# Altium project IR_Sensor_Array.PrjPcb
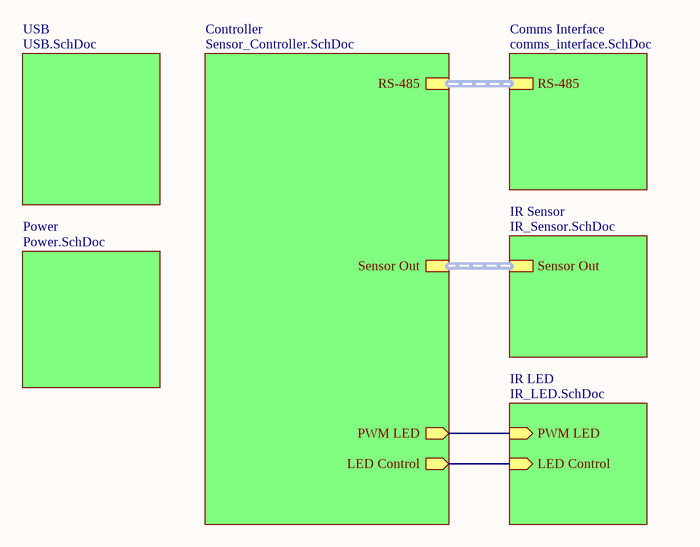
[diagram p0: root.SchDoc]
7 sheets, 89 parts. Net scope: hierarchical (ports join the sheet entries above them; power ports are global).
Board file: PCB.PcbDoc
Sheets:
  root.SchDoc
    Controller = Sensor_Controller.SchDoc
    IR LED = IR_LED.SchDoc
    IR Sensor = IR_Sensor.SchDoc
    Comms Interface = comms_interface.SchDoc
    Power = Power.SchDoc
    USB = USB.SchDoc

## Sheet root.SchDoc
size A4; SheetNumber: 1; SheetTotal: 7

### Sub-sheets
Comms Interface = comms_interface.SchDoc: RS-485
Controller = Sensor_Controller.SchDoc: RS-485, Sensor Out, PWM LED (out), LED Control (out)
IR LED = IR_LED.SchDoc: PWM LED (in), LED Control (in)
IR Sensor = IR_Sensor.SchDoc: Sensor Out
Power = Power.SchDoc: no entries
USB = USB.SchDoc: no entries

### Nets
LED Control: sheet Controller/LED Control, sheet IR LED/LED Control
PWM LED: sheet Controller/PWM LED, sheet IR LED/PWM LED

### Buses and harness runs
harness sheet Comms Interface/RS-485 = sheet Controller/RS-485
harness sheet Controller/Sensor Out = sheet IR Sensor/Sensor Out

## Sheet Sensor_Controller.SchDoc
size A4; SheetNumber: 2; SheetTotal: 7
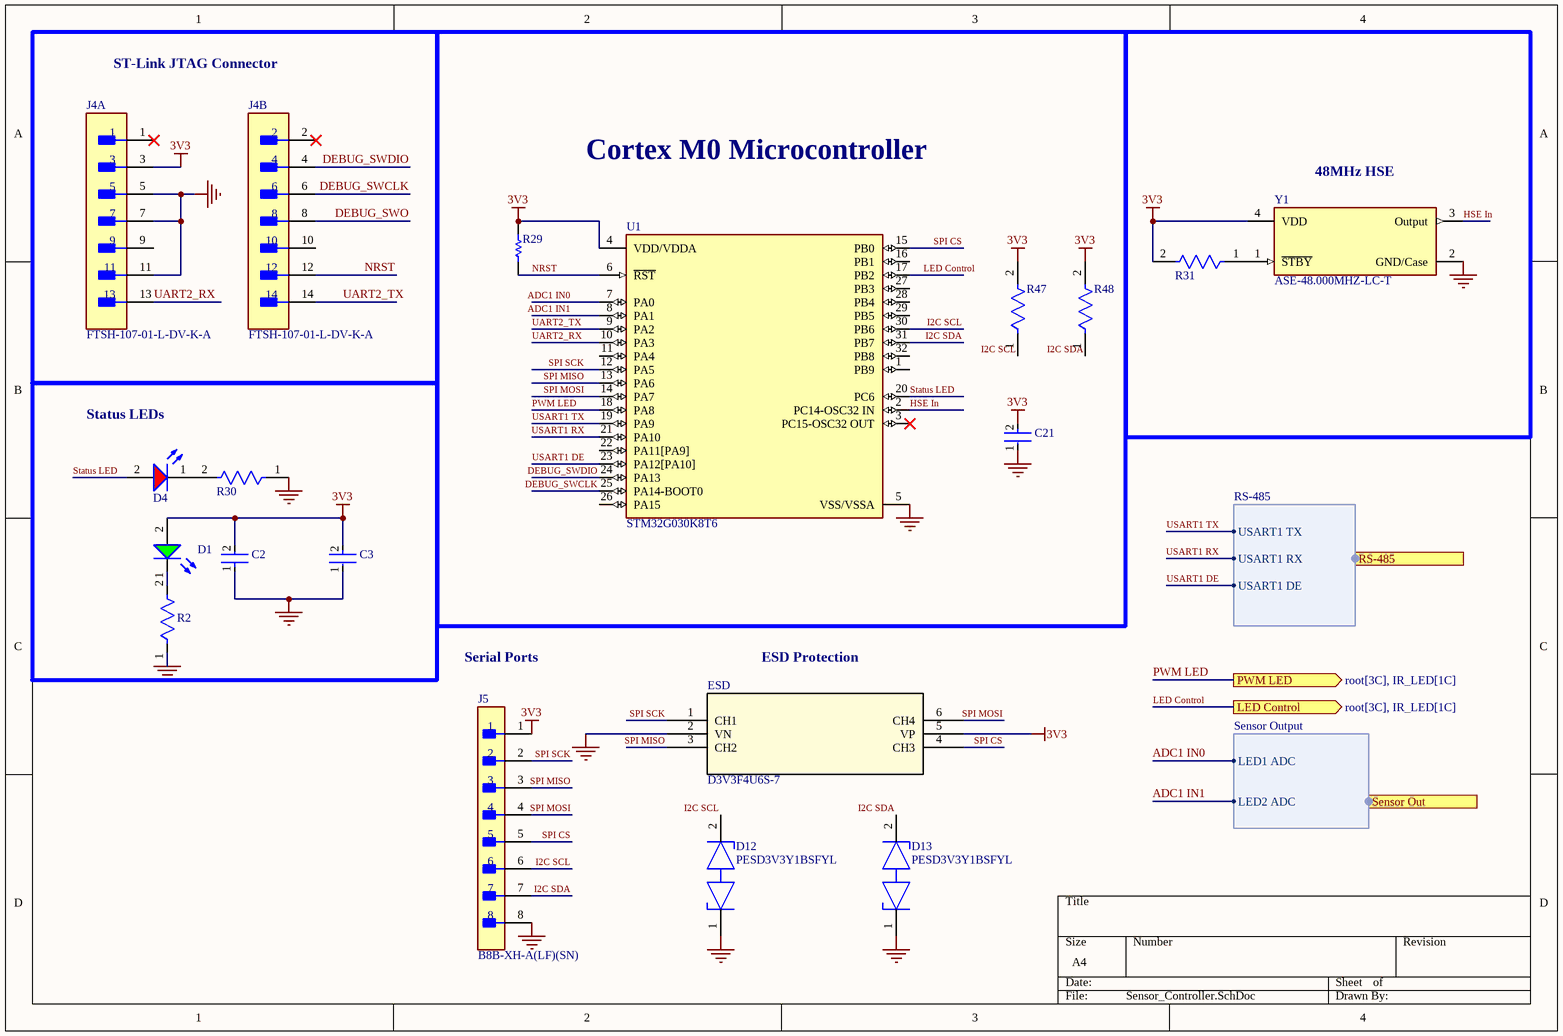
[diagram p1: Sensor_Controller.SchDoc]

### Parts
C2  GRM188R6YA475KE15D  [FP-GRM188-0_2-IPC_C]  (value not drawn)
C3  GRM155R71C104KA88D  [FP-GRM15-MFG]  (value not drawn)
C21  GRM155R71C104KA88D  [FP-GRM15-MFG]  (value not drawn)
D1  150060VS75000  [WL-SMCW_0603_150060xx75000]  (value not drawn)
D4  150060SS75000  [WL-SMCW_0603_150060xx75000]  (value not drawn)
D12  PESD3V3Y1BSFYL  [FP-SOD962-2-CA-MFG]
D13  PESD3V3Y1BSFYL  [FP-SOD962-2-CA-MFG]
ESD  D3V3F4U6S-7  [SOT-363_DIO]
J4  FTSH-107-01-L-DV-K-A  [FP-FTSH-107-01-L-DV-K-A-MFG]  (parts A,B of 2)
J5  B8B-XH-A(LF)(SN)  [FP-B8B-XH-A_LF_SN-MFG]
R2  RC0603FR-0710KL  [FP-RC0603-0_55-IPC_C]  (value not drawn)
R29  TNPW040210K0DEED  [RESC1005X40X20NL05T10]  (value not drawn)
R30  RC0603FR-0710KL  [FP-RC0603-0_55-IPC_C]  (value not drawn)
R31  RC0603FR-0710KL  [FP-RC0603-0_55-IPC_C]  (value not drawn)
R47  CRCW08053K30JNEC  [FP-CRCW0805-e3-IPC_A]  (value not drawn)
R48  CRCW08053K30JNEC  [FP-CRCW0805-e3-IPC_A]  (value not drawn)
U1  STM32G030K8T6  [FP-LQFP32-5V-IPC_A]
Y1  ASE-48.000MHZ-LC-T  [FP-ASE-MFG]

### Blocks framed on the sheet
ST-Link JTAG Connector: J4
Cortex M0 Microcontroller: C21 R29 R47 R48 U1
48MHz HSE: R31 Y1
Status LEDs: C2 C3 D1 D4 R2 R30

### Ports
LED Control (out, see root[3C], IR_LED[1C]), PWM LED (out, see root[3C], IR_LED[1C]), RS-485 (harness RS-485, see root[3B], comms_interface[1D]), Sensor Out (harness Sensor Output, see root[3B], IR_Sensor[4D])

### Harnesses
Sensor Output: LED1 ADC, LED2 ADC
RS-485: USART1 TX, USART1 RX, USART1 DE

### Nets
3V3: C2.2 C3.2 C21.2 D1.2(A) ESD.5(VP) J4.3 J5.1 R29.2 R31.2 R47.2 R48.2 U1.4(VDD/VDDA) Y1.4(VDD)
GND: C2.1 C3.1 C21.1 D12.1 D13.1 ESD.2(VN) J4.5 J4.7 J4.11 J5.8 R2.1 R30.1 U1.5(VSS/VSSA) Y1.2(GND/Case)
ADC1 IN0: U1.7(PA0) ; port Sensor Out.LED1 ADC
ADC1 IN1: U1.8(PA1) ; port Sensor Out.LED2 ADC
DEBUG_SWCLK: J4.6 U1.25(PA14-BOOT0)
DEBUG_SWDIO: J4.4 U1.24(PA13)
DEBUG_SWO: J4.8
HSE In: U1.2(PC14-OSC32_IN) Y1.3(Output)
I2C SCL: D12.2 J5.6 R47.1 U1.30(PB6)
I2C SDA: D13.2 J5.7 R48.1 U1.31(PB7)
LED Control: U1.17(PB2) ; port LED Control
NRST: J4.12 R29.1 U1.6(~{RST})
PWM LED: U1.18(PA8) ; port PWM LED
SPI CS: ESD.4(CH3) J5.5 U1.15(PB0)
SPI MISO: ESD.3(CH2) J5.3 U1.13(PA6)
SPI MOSI: ESD.6(CH4) J5.4 U1.14(PA7)
SPI SCK: ESD.1(CH1) J5.2 U1.12(PA5)
Status LED: D4.2(A) U1.20(PC6)
UART2_RX: J4.13 U1.10(PA3)
UART2_TX: J4.14 U1.9(PA2)
USART1 DE: U1.23(PA12[PA10]) ; port RS-485.USART1 DE  [project net Direction Control]
USART1 RX: U1.21(PA10) ; port RS-485.USART1 RX  [project net RX]
USART1 TX: U1.19(PA9) ; port RS-485.USART1 TX  [project net TX]
NetD1_1: D1.1(K) R2.2
NetD4_1: D4.1(K) R30.2
NetR31_1: R31.1 Y1.1(~{STBY})

Not connected (* = marked no-connect by the designer): J4 1* 2* 9 10; U1 1(PB9) 3(PC15-OSC32_OUT)* 11(PA4) 16(PB1) 22(PA11[PA9]) 26(PA15) 27(PB3) 28(PB4) 29(PB5) 32(PB8)

### Notes on the sheet
- Serial Ports
- ESD Protection

### Library data of the parts
C2 = CMP-2006-02545-2: Chip Multilayer Ceramic Capacitors for General Purpose, 0603, 4.7uF, X5R, 15%, 10%, 35V; Lead Free: Lead Free; Max Operating Temperature: 85°C; Case Code (Imperial): 0603; Capacitance: 4.7uF; Width: 0.8mm; Thickness: 0.031inch; Case Code (Metric): 1608; Min Operating Temperature: -55°C; Voltage Rating (DC): 35V; Dielectric: X5R; Voltage: 35V; Packaging: Tape and Reel; Resistor Type: Ceramic; Weight: 0.000222oz; Mount: Surface Mount; Material: Ceramic; Depth: 0.8mm; Tolerance: 10%; REACH SVHC: No SVHC; Case/Package: 0603; Voltage Rating: 35V; Package Quantity: 4000; Height: 0.8mm; Length: 1.6mm; Termination: SMD/SMT
C3 C21 = CMP-2100-03641-2: CAP CER 0.1UF 16V X7R 0402; Manufacturer: Murata; Standoff Height: 0mm; Tolerance: 10%; Voltage Rating: 16Vdc; Material: Ceramic; Capacitance: 0.10μF; Value: 0.10μF; RoHS: TRUE; Manufacturer Part Number: GRM155R71C104KA88D; Temperature Characteristic: X7R; Octopart: https://octopart.com/grm155r71c104ka88d-murata-196880; Digikey Description: CAP CER 0.1UF 16V X7R 0402; Device Class L3: Ceramic Capacitors; Height: 0.55mm; ComponentLink2Description: Datasheet; Temperature Range Low: -55°C; Ipc Land Pattern Name: CAPC10050X219; ComponentLink2URL: https://search.murata.co.jp/Ceramy/image/img/A01X/G101/ENG/GRM155R71H471KA01-01A.pdf; Device Class L1: Passive Components; Lead Free: yes; Category: Cap; Package: GRM15; Temperature: -55°C to +125°C; Device Class L2: Capacitors; Temperature Range High: +125°C; Mouser Description: 0402 0.1 uF 16V ±10 % Tolerance X7R SMT Multilayer Ceramic Capacitor
D1 = CMP-1426-00006-7: WURTH ELEKTRONIK - 150060VS75000 - LED, Green, SMD, 0603, 30 mA, 2 V, 570 nm; Reverse Voltage: 5V; Power Dissipation: 72mW; Dominant Wavelength: 570nm; Peak Wavelength: 572nm; Forward Current: 100mA; Forward Voltage: 2V; Lens Style: Clear, Rectangular; Test Current: 20mA; Max Junction Temperature (Tj): 95°C; Viewing Angle: 140°; Luminous Intensity: 40mcd; Height: 700µm; Width: 800µm; Length: 1.6mm; Mount: Surface Mount; Min Operating Temperature: -40°C; Max Reverse Voltage (DC): 5V; Case Code (Imperial): 0603; Wavelength: 570nm; Color: Green; REACH SVHC: Unknown; RoHS: Compliant; Max Operating Temperature: 85°C; Packaging: Tape and Reel; Case/Package: 0603; Number of Pins: 2; Case Code (Metric): 1608
D4 = CMP-1426-00004-3: Led, Red, 630 Nm, 1.9 V, 30 Ma, 60 Mcd Rohs Compliant: Yes; Dominant Wavelength: 630nm; Lens Style: Clear, Rectangular; Forward Current: 100mA; Test Current: 20mA; Viewing Angle: 140°; Forward Voltage: 1.9V; Peak Wavelength: 645nm; Max Reverse Voltage (DC): 5V; Luminous Intensity: 60mcd; Color: Red; Height: 700µm; Min Operating Temperature: -40°C; Case Code (Imperial): 0603; REACH SVHC: Unknown; RoHS: Compliant; Length: 1.6mm; Case Code (Metric): 1608; Mount: Surface Mount; Wavelength: 630nm; Packaging: Tape and Reel; Max Operating Temperature: 85°C; Width: 800µm; Case/Package: 0603
D12 D13 = CMP-11424-92175759-2: PESD3V3Y1BSFYL PESD4V0Y1BSF - Extremely low capacitance bidirectional ESD protection diode; Manufacturer Lifecycle Status: RELEASED FOR SUPPLY; Number of Channels: 1; Breakdown Voltage: 4.2V; Clamping Voltage: 3.7V; Capacitance: 240fF; Reverse Standoff Voltage: 3.3V; Height: 320µm; RoHS: Non-Compliant; Ambient Temperature Range High: 125°C; NexarPartId: 92175759; Direction: Bidirectional; Lifecycle Status: Production; Schedule B: 8536300000
ESD = D3V3F4U6S-7: No Description Available; Manufacturer_Name: Diodes Inc; Copyright: Copyright (C) 2026 Ultra Librarian. All rights reserved.; Manufacturer_Part_Number: D3V3F4U6S-7; RefDes: RefDes; Type: Type
J4 = CMP-02766-001414-1: CONN HEADER SMD 14POS 1.27MM; Number of Contacts: 14; Gender: Male; Contact Plating: Gold; Termination: Solder; Lead Free: Lead Free; Contact Material: Bronze; Pitch: 1.27mm; Number of Rows: 2; RoHS Compliant: Yes
J5 = CMP-17438-000015-1: CONN HEADER VERT 8POS 2.5MM; Voltage Rating (AC): 250V; Insulation Resistance: 1GR; Connector Type: Male Pin; Max Current Rating: 3A; Wire/Cable Gauge: 22AWG; Number of Contacts: 8; Contact Resistance: 20mR; Orientation: Straight; Pitch: 2.5mm; Min Operating Temperature: -25°C; Number of Rows: 1; Contact Type: Male Pin; Packaging: Bulk; Lead Free: Lead Free; Max Operating Temperature: 85°C; Housing Material: Polyamide; Voltage Rating: 250V; Series: XH; Mount: Through Hole; Depth: 5.75mm; Contact Material: Brass; Fastening Type: Detent; Color: Natural; Max Voltage Rating (AC): 250V; Number of Positions: 8; Housing Color: White; Contact Plating: Tin; Lead Pitch: 2.5mm; Length: 22.4mm; REACH SVHC: No SVHC; Termination: Press-Fit; Current Rating: 3A
R2 R30 R31 = CMP-2100-03664-2: RES 10K OHM 1% 1/10W 0603; Voltage Rating: 75V; Voltage Rating (DC): 50V; Resistance: 10kR; Power Rating: 100mW; Temperature Coefficient: 100ppm/°C; Depth: 0.8mm; Termination: SMD/SMT; Resistor Type: Thick Film; Series: RC; Construction: Rectangular; Features: Moisture Resistant; Packaging: Tape and Reel; Min Operating Temperature: -55°C; Number of Terminations: 2; Lead Pitch: 0.3mm; RoHS Compliant: Yes; Case/Package: 0603; Resistance Tolerance: 1%; Military Standard: Not; Weight: 7.1E-05oz; Number of Pins: 2; Tolerance: 1%; Length: 1.6mm; Case Code (Imperial): 0603; Lead Free: Lead Free; Width: 0.8mm; Max Power Dissipation: 100mW; Height: 0.45mm; Max Operating Temperature: 155°C; Case Code (Metric): 1608; Size Code: 0603
R29 = CMP-2002-01682-1: Manufacturer: Vishay BCcomponents; Part Number: TNPW040210K0DEED
R47 R48 = CMP-02407-009350-1: RES Thick Film, 3.3kΩ, 5%, 0.125W, 200ppm/°C, 0805; Resistance: 3.3kR; Max Power Dissipation: 125mW; Width: 0.049inch; Contact Plating: Tin; Length: 0.079inch; Height: 0.02inch; Features: Automotive AEC-Q200; Case/Package: 0805; Tolerance: 5%; Min Operating Temperature: -55°C; Number of Terminations: 2; Temperature Coefficient: 200ppm/°C; Lead Free: Lead Free; Packaging: Tape and Reel; Radiation Hardening: No; Max Operating Temperature: 155°C; Package Quantity: 20000; Composition: Thick Film
U1 = CMP-12105-000136-1: IC MCU 32BIT 64KB FLASH 32LQFP; RoHS Compliant: Yes
Y1 = CMP-27762-000273-1: XTAL Oscillator 48MHz ±50ppm CMOS 3.3V 4-SMD 3.2mm x 2.5mm; Min Supply Voltage: 3.135V; Max Supply Voltage: 3.465V; Load Capacitance: 15pF; Max Supply Current: 19mA; Series: ASE; Radiation Hardening: No; Lead Free: Lead Free; Package Quantity: 1000; Frequency: 48MHz; Frequency Stability: 50ppm; Case/Package: SMD/SMT; REACH SVHC: No SVHC; Operating Frequency: 48 MHz; Mount: Surface Mount; Min Operating Temperature: -40°C; Packaging: Tape and Reel; Max Operating Temperature: 85°C; Depth: 2.5mm; Height: 0.047inch; Width: 0.098inch; Length: 3.2mm; Termination: SMD/SMT; Number of Pins: 4; Operating Supply Voltage: 3.3V

## Sheet IR_LED.SchDoc
size A4; SheetNumber: 3; SheetTotal: 7
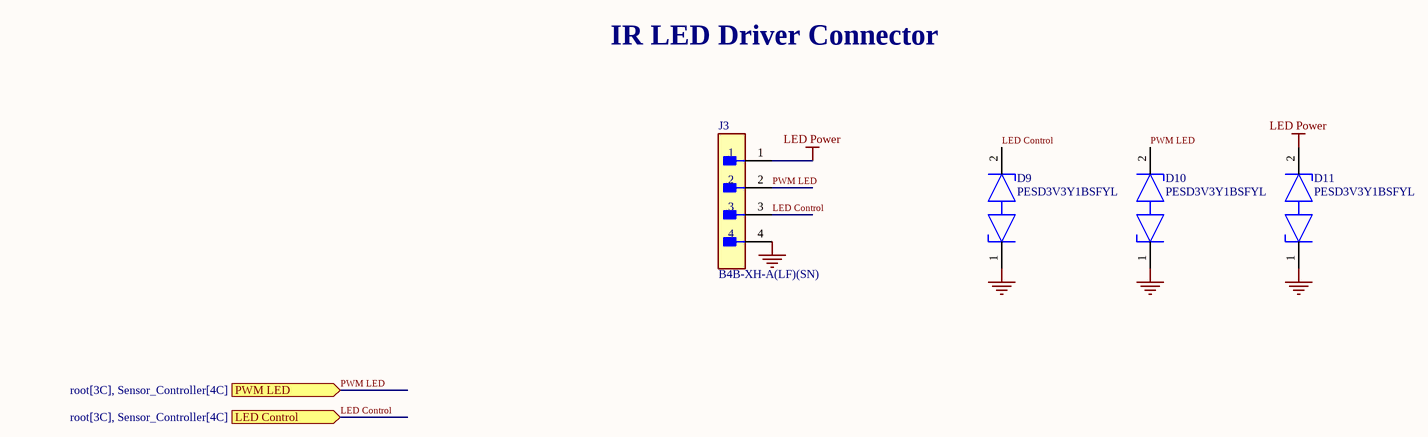
[diagram p2: IR_LED.SchDoc]

### Parts
D9  PESD3V3Y1BSFYL  [FP-SOD962-2-CA-MFG]
D10  PESD3V3Y1BSFYL  [FP-SOD962-2-CA-MFG]
D11  PESD3V3Y1BSFYL  [FP-SOD962-2-CA-MFG]
J3  B4B-XH-A(LF)(SN)  [FP-B4B-XH-A_LF_SN-MFG]

### Ports
LED Control (in, see root[3C], Sensor_Controller[4C]), PWM LED (in, see root[3C], Sensor_Controller[4C])

### Nets
GND: D9.1 D10.1 D11.1 J3.4
LED Power: D11.2 J3.1
LED Control: D9.2 J3.3 ; port LED Control
PWM LED: D10.2 J3.2 ; port PWM LED

### Notes on the sheet
- IR LED Driver Connector

### Library data of the parts
D9-D11 = CMP-11424-92175759-2: as D12 on sheet Sensor_Controller; Height: 320µm; RoHS: Non-Compliant; Ambient Temperature Range High: 125°C; NexarPartId: 92175759; Direction: Bidirectional; Lifecycle Status: Production; Schedule B: 8536300000
J3 = CMP-17439-000250-1: CONN HEADER VERT 4POS 2.5MM; Number of Contacts: 4; Contact Resistance: 20mR; Voltage Rating: 250V; Max Current Rating: 3A; Gender: Male; Wire/Cable Gauge: 22AWG; Mated Stacking Heights: 9.8mm; Insulation Resistance: 1GR; Orientation: Straight; Contact Type: Male Pin; Contact Finish - Mating: TIN; Series: XH; Max Voltage Rating (AC): 250V; Lead Pitch: 2.5mm; Contact Shape: Square; Insulation Color: Natural; Termination: Solder; Lead Free: Lead Free; Voltage Rating (AC): 250V; Number of Rows: 1; Flammability Rating: UL94 V-0; Number of Positions: 4; Max Operating Temperature: 85°C; Package Quantity: 500; Mount: Through Hole; REACH SVHC: No SVHC; Connector Type: Header; Insulation Material: Nylon; Fastening Type: Detent; Min Operating Temperature: -25°C; Housing Color: White; Packaging: Bulk; Contact Plating: Tin; Contact Material: Brass; Max Voltage Rating (DC): 250V; Housing Material: Polyamide; Color: Natural; Material: Polyamide; Pitch: 2.5mm; Depth: 5.75mm; Current Rating: 3A; Length: 12.4mm

## Sheet IR_Sensor.SchDoc
size A4; SheetNumber: 4; SheetTotal: 7
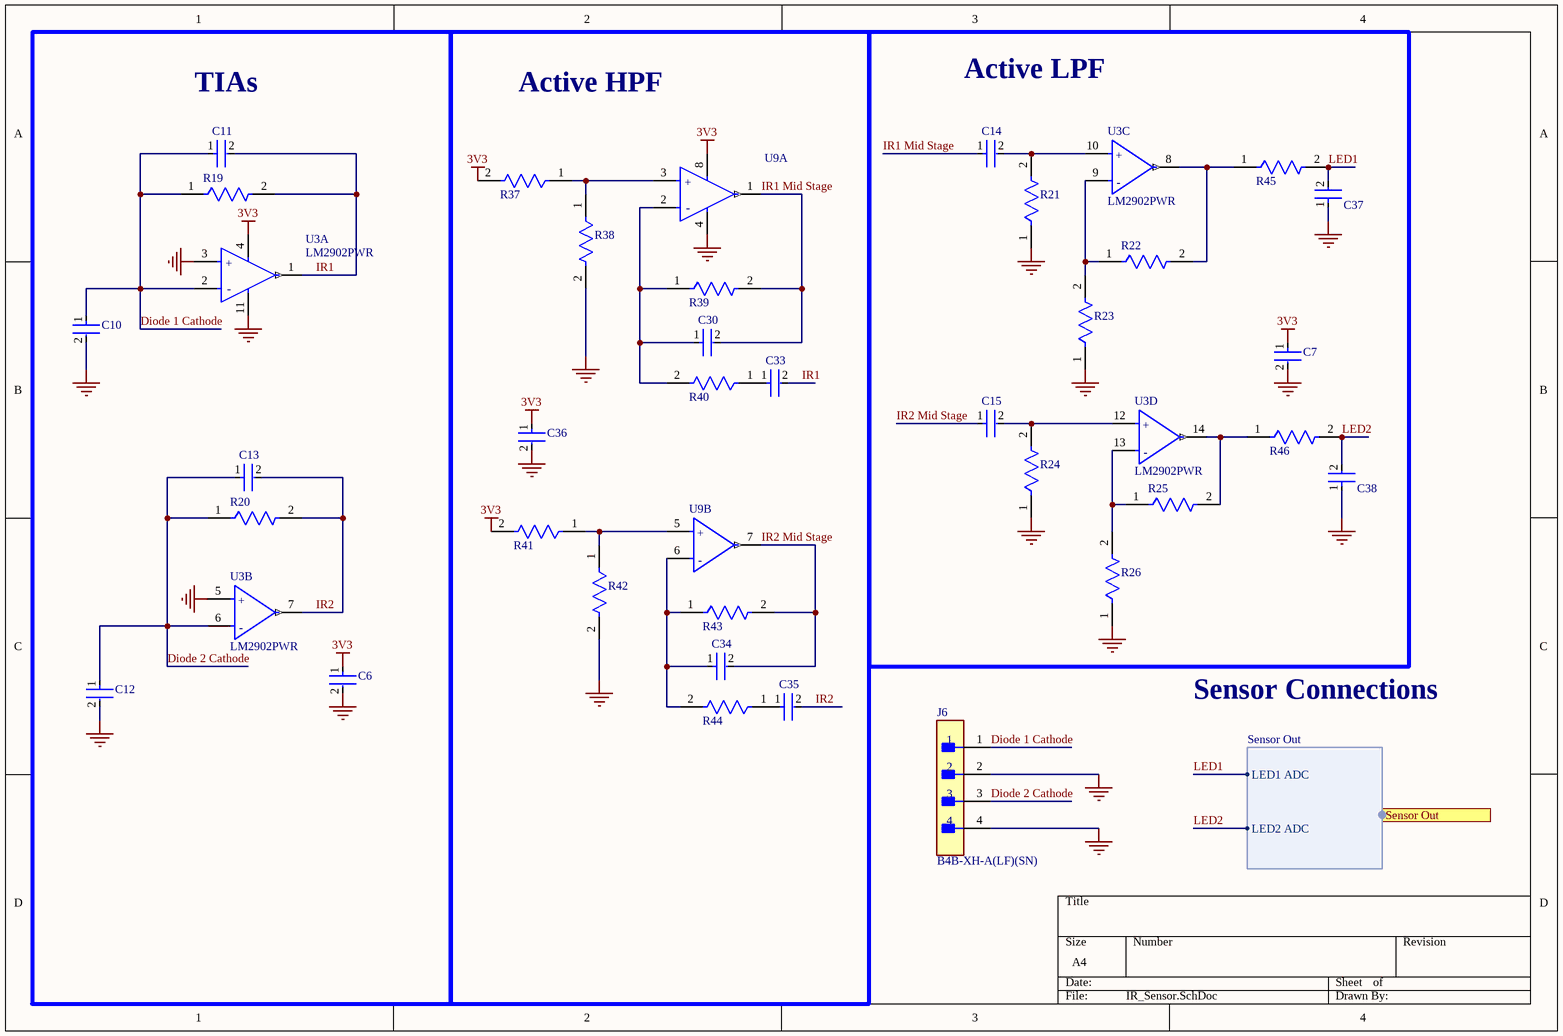
[diagram p3: IR_Sensor.SchDoc]

### Parts
C6  LMK105B7104KVHF  [FP-0402-L_1_0_0_05-W_0_5-IPC_B]  (value not drawn)
C7  LMK105B7104KVHF  [FP-0402-L_1_0_0_05-W_0_5-IPC_B]  (value not drawn)
C10  GCM1555C1H4R0CA16D  [FP-GCM155-0_05-MFG]  (value not drawn)
C11  C0603C100D5GACAUTO  [FP-C0603C-CF-MFG]  (value not drawn)
C12  GCM1555C1H4R0CA16D  [FP-GCM155-0_05-MFG]  (value not drawn)
C13  C0603C100D5GACAUTO  [FP-C0603C-CF-MFG]  (value not drawn)
C14  C0603C104K3RACTU  [FP-C0603C-CF-MFG]  (value not drawn)
C15  C0603C104K3RACTU  [FP-C0603C-CF-MFG]  (value not drawn)
C30  C0603C100D5GACAUTO  [FP-C0603C-CF-MFG]  (value not drawn)
C33  C0603C104K3RACTU  [FP-C0603C-CF-MFG]  (value not drawn)
C34  C0603C100D5GACAUTO  [FP-C0603C-CF-MFG]  (value not drawn)
C35  C0603C104K3RACTU  [FP-C0603C-CF-MFG]  (value not drawn)
C36  LMK105B7104KVHF  [FP-0402-L_1_0_0_05-W_0_5-IPC_B]  (value not drawn)
C37  C0603C104K3RACTU  [FP-C0603C-CF-MFG]  (value not drawn)
C38  C0603C104K3RACTU  [FP-C0603C-CF-MFG]  (value not drawn)
J6  B4B-XH-A(LF)(SN)  [FP-B4B-XH-A_LF_SN-MFG]
R19  MCT0603MD1002DP500  [FP-MCT0603-IPC_A]  (value not drawn)
R20  MCT0603MD1002DP500  [FP-MCT0603-IPC_A]  (value not drawn)
R21  AC0603JR-0747KL  [FP-AC0603-IPC_A]  (value not drawn)
R22  RT0603DRE073K3L  [FP-RT0603-MFG]  (value not drawn)
R23  AT0603BRD071KL  [FP-AT0603-IPC_A]  (value not drawn)
R24  AC0603JR-0747KL  [FP-AC0603-IPC_A]  (value not drawn)
R25  RT0603DRE073K3L  [FP-RT0603-MFG]  (value not drawn)
R26  AT0603BRD071KL  [FP-AT0603-IPC_A]  (value not drawn)
R37  CRCW0603100KFKEI  [FP-CRCW0603-e3-MFG]  (value not drawn)
R38  CRCW0603100KFKEI  [FP-CRCW0603-e3-MFG]  (value not drawn)
R39  CRCW0603100KFKEI  [FP-CRCW0603-e3-MFG]  (value not drawn)
R40  AC0603JR-7W10KL  [FP-AC0603-IPC_A]  (value not drawn)
R41  CRCW0603100KFKEI  [FP-CRCW0603-e3-MFG]  (value not drawn)
R42  CRCW0603100KFKEI  [FP-CRCW0603-e3-MFG]  (value not drawn)
R43  CRCW0603100KFKEI  [FP-CRCW0603-e3-MFG]  (value not drawn)
R44  AC0603JR-7W10KL  [FP-AC0603-IPC_A]  (value not drawn)
R45  CRCW0603100KFKEI  [FP-CRCW0603-e3-MFG]  (value not drawn)
R46  CRCW0603100KFKEI  [FP-CRCW0603-e3-MFG]  (value not drawn)
U3  LM2902PWR  [FP-PW0014A-IPC_C]  (parts A,B,C,D of 4)
U9  LMV358AIDR  [FP-D0008A-IPC_C]  (value not drawn)  (parts A,B of 2)

### Blocks framed on the sheet
TIAs: C6 C10-C13 R19 R20 U3
Active HPF: C30 C33-C36 R37-R44 U9
Active LPF: C7 C14 C15 C37 C38 R21-R26 R45 R46 U3

### Ports
Sensor Out (harness Sensor Out, see root[3B], Sensor_Controller[4D])

### Harnesses
Sensor Out: LED2 ADC, LED1 ADC

### Nets
3V3: C6.1 C7.1 C36.1 R37.2 R41.2 U3.4(VCC) U9.8(V+)
GND: C6.2 C7.2 C10.2 C12.2 C36.2 C37.1 C38.1 J6.2 J6.4 R21.1 R23.1 R24.1 R26.1 R38.2 R42.2 U3.3(1IN+) U3.5(2IN+) U3.11(GND) U9.4(V-)
Diode 1 Cathode: C10.1 C11.1 J6.1 R19.1 U3.2(1IN-)
Diode 2 Cathode: C12.1 C13.1 J6.3 R20.1 U3.6(2IN-)
IR1: C11.2 C33.2 R19.2 U3.1(1OUT)
IR1 Mid Stage: C14.1 C30.2 R39.2 U9.1(OUT_A)
IR2: C13.2 C35.2 R20.2 U3.7(2OUT)
IR2 Mid Stage: C15.1 C34.2 R43.2 U9.7(OUT_B)
LED1: C37.2 R45.2 ; port Sensor Out.LED1 ADC  [project net ADC1 IN0]
LED2: C38.2 R46.2 ; port Sensor Out.LED2 ADC  [project net ADC1 IN1]
NetC14_2: C14.2 R21.2 U3.10(3IN+)
NetC15_2: C15.2 R24.2 U3.12(4IN+)
NetC30_1: C30.1 R39.1 R40.2 U9.2(-IN_A)
NetC33_1: C33.1 R40.1
NetC34_1: C34.1 R43.1 R44.2 U9.6(-IN_B)
NetC35_1: C35.1 R44.1
NetR22_1: R22.1 R23.2 U3.9(3IN-)
NetR22_2: R22.2 R45.1 U3.8(3OUT)
NetR25_1: R25.1 R26.2 U3.13(4IN-)
NetR25_2: R25.2 R46.1 U3.14(4OUT)
NetR37_1: R37.1 R38.1 U9.3(+IN_A)
NetR41_1: R41.1 R42.1 U9.5(+IN_B)

### Notes on the sheet
- Sensor Connections
- (in symbol CMP-04895-000145-1, part A) +; -
- (in symbol CMP-04895-000145-1, part B) +; -
- (in symbol CMP-04895-000145-1, part C) +; -
- (in symbol CMP-04895-000145-1, part D) +; -
- (in symbol CMP-04895-000233-1, part A) +; -
- (in symbol CMP-04895-000233-1, part B) +; -

### Library data of the parts
C6 C7 C36 = CMP-14477-001294-2: None; Tolerance: 10%; Voltage Rating: 10V; Capacitance: 100nF; Lead Free: Lead Free; Case/Package: 0402; Length: 0.039inch; Thickness: 0.022inch; Halogen Free: Halogen Free; Mount: Surface Mount; Packaging: Tape and Reel; Width: 0.02inch; Case Code (Metric): 1005; Voltage Rating (DC): 10V; Case Code (Imperial): 0402; Min Operating Temperature: -55°C; RoHS Compliant: Yes; Max Operating Temperature: 125°C; Ratings: AEC-Q200
C10 C12 = CMP-06035-062171-1: Ceramic Capacitor for Automotive 4pF ±0.25pF 50VDC C0G 0402 Paper T/R; Voltage Rating: 50V; Mount: Surface Mount; Min Operating Temperature: -55°C; Package Quantity: 10000; Case/Package: 0402; Case Code (Imperial): 0402; Thickness: 0.022inch; Dielectric: C0G; Length: 0.039inch; Ratings: AEC-Q200; Max Operating Temperature: 125°C; Voltage Rating (DC): 50V; Packaging: Tape and Reel; RoHS Compliant: Yes; Termination: SMD/SMT; Weight: 0.000212oz; Capacitance: 4pF; Case Code (Metric): 1005; Width: 0.02inch; Height: 0.5mm
C11 C13 C30 C34 = CMP-03020-010987-1: C0603 10 pF C0G 30ppm/°C 0.5 pF 50 V; Manufacturer: KEMET; Tolerance: 0.5 pF; Automotive Grade: Grade 1; Value: 10 pF; Material: Ceramic; Voltage Rating: 50 V; ComponentLink2URL: https://api.kemet.com/component-edge/download/datasheet/C0603C100J5GACAUTO.pdf; Manufacturer Part Number: C0603C100D5GACAUTO; Temperature Range High: +125°C; Height: 0.87mm; Device Class L3: Ceramic Capacitors; Octopart: https://octopart.com/c0603c100d5gacauto-kemet-81425946; RoHS: TRUE; Temperature: -55°C to +125°C; Lead Free: Yes; Temperature Characteristic: C0G; Category: Cap; ComponentLink2Description: Datasheet; Capacitance: 10 pF; Device Class L2: Capacitors; Temperature Coefficient: 30ppm/°C; Device Class L1: Passive Components; Automotive: Yes; Package: C0603C-CF; Temperature Range Low: -55°C
C14 C15 C33 C35 C37 C38 = CMP-2006-03057-2: CAP CER 0.1UF 25V X7R 0603; Manufacturer: KEMET; Value: 0.10 μF; Material: Ceramic; Tolerance: 0.1; Temperature Coefficient: 30ppm/°C; Automotive Grade: Grade 1; Lead Free: Yes; Device Class L3: Ceramic Capacitors; Voltage Rating: 25 V; Manufacturer Part Number: C0603C104K3RACTU; Digikey Description: CAP CER 0.1UF 25V X7R 0603; Mouser Description: Multilayer Ceramic Capacitors MLCC - SMD/SMT 25volts 0.1uF X7R 10%; Package: C0603C-CF; Temperature Range Low: -55°C; Automotive: Yes; Device Class L2: Capacitors; Octopart: https://octopart.com/c0603c104k3ractu-kemet-127541; ComponentLink2Description: Datasheet; ComponentLink2URL: https://api.kemet.com/component-edge/download/datasheet/C0603C100J5GACAUTO.pdf; Temperature Range High: +125°C; RoHS: TRUE; Device Class L1: Passive Components; Category: Cap; Temperature: -55°C to +125°C; Capacitance: 0.10 μF; Height: 0.87mm; Temperature Characteristic: X7R
J6 = CMP-17439-000250-1: as J3 on sheet IR_LED; Orientation: Straight; Contact Type: Male Pin; Contact Finish - Mating: TIN; Series: XH; Max Voltage Rating (AC): 250V; Lead Pitch: 2.5mm; Contact Shape: Square; Insulation Color: Natural; Termination: Solder; Lead Free: Lead Free; Voltage Rating (AC): 250V; Number of Rows: 1; Flammability Rating: UL94 V-0; Number of Positions: 4; Max Operating Temperature: 85°C; Package Quantity: 500; Mount: Through Hole; REACH SVHC: No SVHC; Connector Type: Header; Insulation Material: Nylon; Fastening Type: Detent; Min Operating Temperature: -25°C; Housing Color: White; Packaging: Bulk; Contact Plating: Tin; Contact Material: Brass; Max Voltage Rating (DC): 250V; Housing Material: Polyamide; Color: Natural; Material: Polyamide; Pitch: 2.5mm; Depth: 5.75mm; Current Rating: 3A; Length: 12.4mm
R19 R20 = CMP-02407-010942-1: RES SMD 100 OHM 1% 1/8W 0603; Power Rating: 125mW; Resistance: 10kR; Tolerance: 0.5%; Temperature Coefficient: 25ppm/°C; Max Power Dissipation: 150mW; Voltage Rating: 75V; Case Code (Imperial): 0603; Case Code (Metric): 1608; Military Standard: Not; Lead Free: Lead Free; Max Operating Temperature: 175°C; Length: 1.55mm; Height: 0.022inch; Min Operating Temperature: -55°C; Width: 0.8mm; Package Quantity: 1; Contact Plating: Tin; Termination: Wraparound; Composition: Thin Film; Case/Package: 0603; Number of Terminations: 2; Depth: 0.85mm; Features: Automotive AEC-Q200; Mount: Surface Mount; Voltage Rating (DC): 75V; Packaging: Tape and Reel; REACH SVHC: No SVHC
R21 R24 = CMP-03412-049221-1: RES 47kΩ 5.00% 0.1W 0603; Resistance: 47kR; Tolerance: 5%; Temperature Coefficient: 100ppm/°C; Max Power Dissipation: 100mW; Voltage Rating: 50V; Packaging: Tape and Reel; Series: AC; Ratings: AEC-Q200; Case Code (Metric): 1608; Case Code (Imperial): 0603; Resistor Type: Thick Film; Max Operating Temperature: 155°C; Case/Package: 0603; Features: Moisture Resistant; Height: 0.45mm; Termination: SMD/SMT; Length: 1.6mm; Min Operating Temperature: -55°C; Number of Terminations: 2; Width: 0.8mm; RoHS Compliant: Yes; Power Rating: 100mW
R22 R25 = CMP-03412-032896-1: RES 3.30K OHM 1/10W .5% SMD 0603; Manufacturer: Yageo; Resistance: 3.3KΩ; Value: 3.3KΩ; Voltage Rating: 75V; Power Rating: 0.1W; Tolerance: 0.005; Temperature Coefficient: 50 ppm/°C; Composition: Thin Film; Ipc Land Pattern Name: RESC16080X45; ComponentLink2URL: http://www.yageo.com/documents/recent/PYu-RT_1-to-0.01_RoHS_L_9.pdf; Mouser Description: High Precision-High Stability Chip Resistor Thin Film 0603 3.3kOhm 0.5% Paper T/R; Automotive: No; Temperature Range High: +155°C; Device Class L3: Chip SMD Resistors; RoHS: TRUE; Lead Free: Yes; Octopart: https://octopart.com/rt0603dre073k3l-yageo-1479702; Series: RT; Digikey Description: RES 3.30K OHM 1/10W .5% SMD 0603; Device Class L2: Resistors; Manufacturer Part Number: RT0603DRE073K3L; Temperature Range Low: -55°C; Package: RT0603; Category: Res; Footprint Url: http://www.yageo.com/exep/pages/download/literatures/PYu-R_Mount_10.pdf; Temperature: -55°C to +155°C; ComponentLink2Description: Datasheet; Height: 0.55mm; Device Class L1: Passive Components
R23 R26 = CMP-03412-045054-1: Thin Film Chip Resistors Automotive Grade 1kΩ 0.1% 25ppm/°C 0603; Resistance: 1kR; Max Power Dissipation: 100mW; RoHS Compliant: Yes; Case Code (Metric): 1608; Features: Moisture Resistant; Tolerance: 0.1%; Case/Package: 0603; Temperature Coefficient: 25ppm/°C; Height: 0.022inch; Max Operating Temperature: 155°C; Width: 0.032inch; Ratings: AEC-Q200; Series: AT; Length: 0.063inch; Case Code (Imperial): 0603; Packaging: Cut Tape; Resistor Type: Thin Film; Number of Terminations: 2; Min Operating Temperature: -55°C
R37-R39 R41-R43 R45 R46 = CMP-02407-005189-1: RES Thick Film, 100kΩ, 1%, 0.1W, 100ppm/°C, 0603; Resistance: 100kR; Max Power Dissipation: 100mW; Number of Terminations: 2; Temperature Coefficient: 100ppm/°C; Composition: Thick Film; Max Operating Temperature: 155°C; Packaging: Tape and Reel; Lead Free: Lead Free; Min Operating Temperature: -55°C; Case/Package: 0603; Tolerance: 1%; Height: 0.02inch; Length: 0.061inch; Package Quantity: 5000; Width: 0.033inch; Features: Automotive AEC-Q200
R40 R44 = CMP-03412-040683-1: RES 10kΩ 5.00% 0.2W 0603
U3 = CMP-04895-000145-1: IC OPAMP GP 4 CIRCUIT 14TSSOP; Min Supply Voltage: 3V; Operating Supply Voltage: 13V; Unity Gain Bandwidth Product: 1.2MHz; Slew Rate: 0.5V/µs; Dual Supply Voltage: 9V; Voltage Gain: 100dB; Common Mode Rejection Ratio: 50dB; Input Offset Voltage (Vos): 7mV; Operating Supply Current: 1.4mA; Min Dual Supply Voltage: 1.5V; Number of Channels: 4; Output Current per Channel: 60mA; Output Current: 30mA; Nominal Supply Current: 3mA; Input Bias Current: 250nA; Max Supply Voltage: 26V; Min Operating Temperature: -40°C; Max Operating Temperature: 125°C; Mount: Surface Mount; REACH SVHC: No SVHC; Max Dual Supply Voltage: 13V; Lead Free: Lead Free; Number of Pins: 14; Length: 5mm; Width: 4.4mm; Gain Bandwidth Product: 1.2MHz; Height: 1.15mm; Radiation Hardening: No; Package Quantity: 1; Number of Circuits: 4; Packaging: Tape and Reel; Bandwidth: 1.2MHz; Case/Package: TSSOP; Number of Amplifiers: 4; Number of Elements: 4
U9 = CMP-04895-000233-1: IC OPAMP GP 2 CIRCUIT 8SOIC; Gain Bandwidth Product: 1MHz; Number of Channels: 2; Input Offset Voltage (Vos): 1mV; Operating Supply Current: 80uA; Input Bias Current: 10pA; Slew Rate: 1.7V/µs; Min Operating Temperature: -40°C; Number of Circuits: 2; Packaging: Cut Tape; Case/Package: SOIC; RoHS Compliant: Yes; Number of Pins: 8; Mount: Surface Mount; Max Operating Temperature: 125°C

## Sheet comms_interface.SchDoc
size A4; SheetNumber: 5; SheetTotal: 7
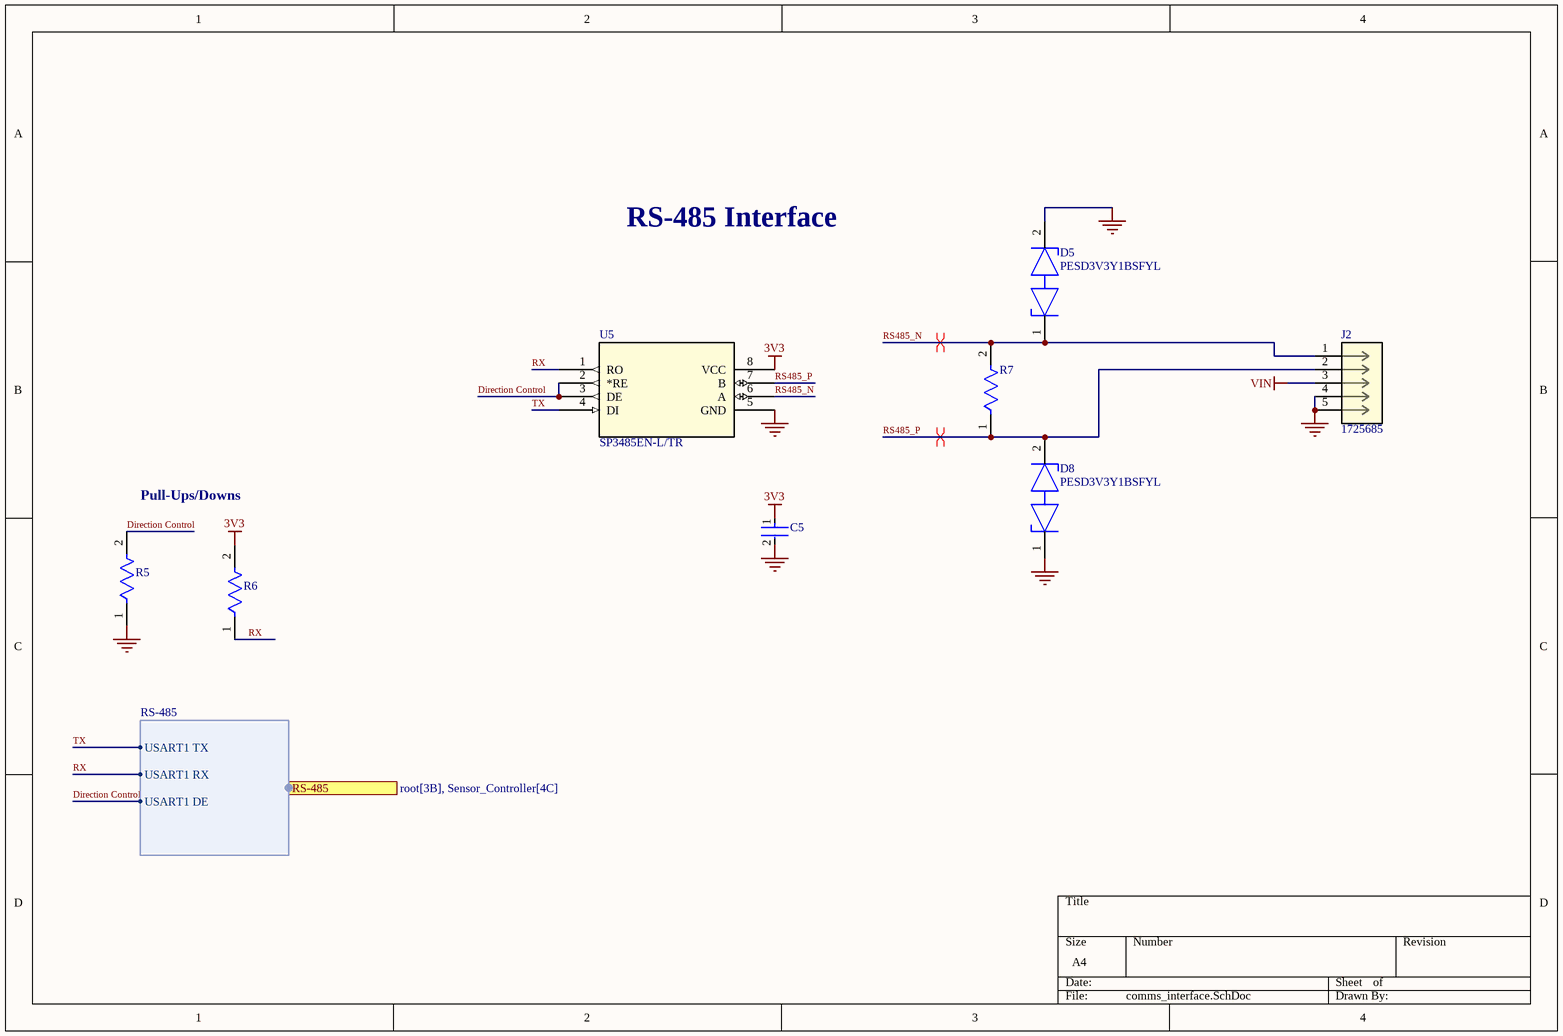
[diagram p4: comms_interface.SchDoc]

### Parts
C5  LMK105B7104KVHF  [FP-0402-L_1_0_0_05-W_0_5-IPC_B]  (value not drawn)
D5  PESD3V3Y1BSFYL  [FP-SOD962-2-CA-MFG]
D8  PESD3V3Y1BSFYL  [FP-SOD962-2-CA-MFG]
J2  1725685  [CONN_1725685_PXC]
R5  AF0402FR-073K3L  [FP-AF0402-IPC_B]  (value not drawn)
R6  AF0402FR-073K3L  [FP-AF0402-IPC_B]  (value not drawn)
R7  AF0402FR-07120RL  [FP-AF0402-IPC_A]  (value not drawn)
U5  SP3485EN-L/TR  [NSOIC-8]

### Ports
RS-485 (harness RS-485, see root[3B], Sensor_Controller[4C])

### Harnesses
RS-485: USART1 TX, USART1 RX, USART1 DE

### Nets
3V3: C5.1 R6.2 U5.8(VCC)
GND: C5.2 D5.2 D8.1 J2.4 J2.5 R5.1 U5.5(GND)
VIN: J2.3
Direction Control: R5.2 U5.2(*RE) U5.3(DE) ; port RS-485.USART1 DE
RS485_N: D5.1 J2.1 R7.2 U5.6(A)
RS485_P: D8.2 J2.2 R7.1 U5.7(B)
RX: R6.1 U5.1(RO) ; port RS-485.USART1 RX
TX: U5.4(DI) ; port RS-485.USART1 TX

### Layout directives
differential pair: RS485_N, RS485_P

### Notes on the sheet
- RS-485 Interface
- Pull-Ups/Downs

### Library data of the parts
C5 = CMP-14477-001294-2: as C6 on sheet IR_Sensor; Lead Free: Lead Free; Case/Package: 0402; Length: 0.039inch; Thickness: 0.022inch; Halogen Free: Halogen Free; Mount: Surface Mount; Packaging: Tape and Reel; Width: 0.02inch; Case Code (Metric): 1005; Voltage Rating (DC): 10V; Case Code (Imperial): 0402; Min Operating Temperature: -55°C; RoHS Compliant: Yes; Max Operating Temperature: 125°C; Ratings: AEC-Q200
D5 D8 = CMP-11424-92175759-2: as D12 on sheet Sensor_Controller; Height: 320µm; RoHS: Non-Compliant; Ambient Temperature Range High: 125°C; NexarPartId: 92175759; Direction: Bidirectional; Lifecycle Status: Production; Schedule B: 8536300000
J2 = 1725685: PCB terminal block, nominal current: 6 A, rated voltage (III/2): 160 V, nominal cross section: 0.5 mmÂ², number of potentials: 5, number of rows: 1, number of positions per row: 5, product range: MPT 0,5, pitch: 2.54 mm, connection method: Screw connection with tension sleeve, screw head form: L Slotted, mounting: Wave soldering, conductor/PCB connection direction: 0 Â°, color: green, Pin layout: Linear pinning, Solder pin [P]: 3.5 mm, number of solder pins per potential: 1, type of packaging: packed in cardboard; Manufacturer_Name: Phoenix Contact; Copyright: Copyright (C) 2026 Ultra Librarian. All rights reserved.; Manufacturer_Part_Number: 1725685; RefDes: RefDes; Type: Type
R5 R6 = CMP-03412-043110-1: Anti-Sulfurated Chip Resistors Automotive Grade 3.3kΩ 1% 100ppm/°C 0402; Max Power Dissipation: 63mW; Resistance: 3.3kR; Length: 0.039inch; Min Operating Temperature: -55°C; Case/Package: 0402; Width: 0.02inch; Height: 0.015inch; Resistor Type: Thick Film; Max Operating Temperature: 155°C; Temperature Coefficient: 100ppm/°C; RoHS Compliant: Yes; Features: Moisture Resistant; Series: AF; Number of Terminations: 2; Tolerance: 1%; Packaging: Tape and Reel
R7 = CMP-03412-046039-1: Anti-Sulfurated Chip Resistors Automotive Grade 120Ω 1% 100ppm/°C 0402; Resistance: 120R; Max Power Dissipation: 63mW; RoHS Compliant: Yes; Resistor Type: Thick Film; Length: 0.039inch; Case/Package: 0402; Temperature Coefficient: 100ppm/°C; Number of Terminations: 2; Packaging: Tape and Reel; Min Operating Temperature: -55°C; Height: 0.015inch; Tolerance: 1%; Max Operating Temperature: 155°C; Features: Moisture Resistant; Width: 0.02inch; Series: AF
U5 = SP3485EN-LTR: No Description Available; Manufacturer_Name: MaxLinear / Exar; Copyright: Copyright (C) 2026 Ultra Librarian. All rights reserved.; Manufacturer_Part_Number: SP3485EN-L/TR; RefDes: RefDes; Type: Type

## Sheet Power.SchDoc
size A4; SheetNumber: 6; SheetTotal: 7
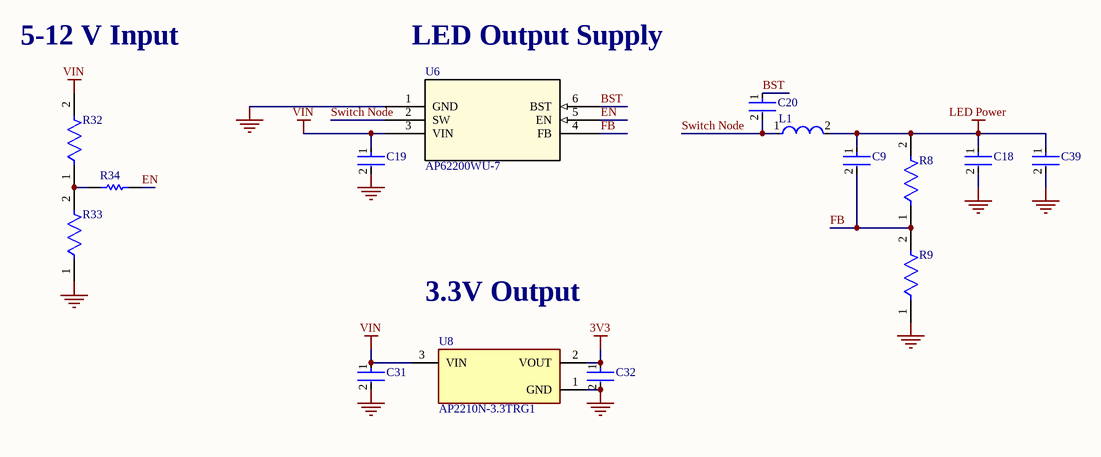
[diagram p5: Power.SchDoc]

### Parts
C9  UMK105CG330JVHF  [FP-0402-L_1_0_0_05-W_0_5-MFG]  (value not drawn)
C18  EMK316BB7226ML-T  [FP-1206-L_3_2_0_3-W_1_6_0-IPC_A]  (value not drawn)
C19  CL21A106KAYNNNE  [FP-CL21-IPC_A]  (value not drawn)
C20  GRM155R71C224KA12D  [FP-GRM155-0_05-IPC_C]  (value not drawn)
C31  GCM21BR71H105MA03L  [FP-GCM21B-0_15-MFG]  (value not drawn)
C32  GCJ21BR71E225KA01L  [FP-GCJ21B-0_3-MFG]  (value not drawn)
C39  EMK316BB7226ML-T  [FP-1206-L_3_2_0_3-W_1_6_0-IPC_A]  (value not drawn)
L1  LQM21PN4R7MGHL  [FP-LQM21PH_G0-IPC_B]  (value not drawn)
R8  ESR10EZPF5232  [FP-ESR10-MFG]  (value not drawn)
R9  AT0805DRE0710KL  [FP-AT0805-MFG]  (value not drawn)
R32  AC0402JR-07200KL  [FP-AC0402-IPC_B]  (value not drawn)
R33  CRCW040250K0FKED  [FP-CRCW0402-e3-IPC_A]  (value not drawn)
R34  RC0402JR-070RL  [RESC1005X40X25NL05T10]  (value not drawn)
U6  AP62200WU-7  [TSOT26-WU_DIO]
U8  AP2210N-3.3TRG1  [FP-SOT23-IPC_C]

### Nets
3V3: C32.1 U8.2(VOUT)
GND: C18.2 C19.2 C31.2 C32.2 C39.2 R9.1 R33.1 U6.1(GND) U8.1(GND)
LED Power: C9.1 C18.1 C39.1 L1.2 R8.2
VIN: C19.1 C31.1 R32.2 U6.3(VIN) U8.3(VIN)
BST: C20.1 U6.6(BST)
EN: R34.2 U6.5(EN)
FB: C9.2 R8.1 R9.2 U6.4(FB)
Switch Node: C20.2 L1.1 U6.2(SW)
NetR32_1: R32.1 R33.2 R34.1

### Notes on the sheet
- 5-12 V Input
- LED Output Supply
- 3.3V Output

### Library data of the parts
C9 = CMP-14477-003555-2: None; Voltage Rating (DC): 50V; Tolerance: 5%; Capacitance: 33pF; Mount: Surface Mount; Case Code (Imperial): 0402; Min Operating Temperature: -55°C; Package Quantity: 10000; Halogen Free: Halogen Free; Voltage Rating: 50V; Packaging: Tape and Reel; Thickness: 0.022inch; Ratings: AEC-Q200; Case/Package: 0402; RoHS Compliant: Yes; Length: 0.039inch; Width: 0.02inch; Case Code (Metric): 1005; Max Operating Temperature: 125°C
C18 C39 = CMP-14477-000099-2: None; Tolerance: 20%; Voltage Rating: 16V; Capacitance: 22uF; Dielectric: X7R; Lead Free: Lead Free; Min Operating Temperature: -55°C; Max Operating Temperature: 125°C; Case/Package: 1206; RoHS Compliant: Yes; Case Code (Metric): 3216; Width: 0.063inch; Case Code (Imperial): 1206; Thickness: 0.071inch; Packaging: Tape and Reel; Length: 0.126inch; Mount: Surface Mount
C19 = CMP-13271-002975-1: CL21 Series 0805 10uF 25V ±10% Tolerance X5R Multilayer Ceramic Chip Capacitor; Case Code (Imperial): 0805; Length: 2mm; Case/Package: 0805; Packaging: Tape and Reel; Width: 0.049inch; Tolerance: 10%; Mount: Surface Mount; Min Operating Temperature: -55°C; Thickness: 0.057inch; Height: 1.25mm; Dielectric: X5R; Package Quantity: 1; Depth: 1.25mm; Capacitance: 10uF; Voltage Rating: 25V; Case Code (Metric): 2012; Max Operating Temperature: 85°C; Radiation Hardening: No
C20 = CMP-1034-02089-3: Chip Multilayer Ceramic Capacitors for General Purpose, 0402, 0.22uF, X7R, 15%, 10%, 16V; Capacitance: 220nF; Depth: 0.5mm; Dielectric: X7R; Min Operating Temperature: -55°C; Package Quantity: 1; Termination: SMD/SMT; Mount: Surface Mount; Radiation Hardening: No; Height: 0.5mm; Case Code (Metric): 1005; Packaging: Tape and Reel; Material: Ceramic; Voltage: 16V; Voltage Rating (DC): 16V; REACH SVHC: No SVHC; Voltage Rating: 16V; Length: 1mm; Tolerance: 10%; Thickness: 0.022inch; Case Code (Imperial): 0402; Max Operating Temperature: 125°C; Width: 0.02inch; Lead Free: Lead Free; Case/Package: 0402
C31 = CMP-06035-008660-1: Ceramic Capacitor for Automotive 1uF ±20% 50VDC X7R 0805 Embossed T/R
C32 = CMP-06035-015979-1: Multilayer Ceramic Capacitors MLCC - SMD/SMT 0805 2.2uF 10%, 25VDC,  X7R 15%
L1 = CMP-06042-016464-1: Multilayer Type Inductor for Power Lines, 0805 (2012), 4.7μH, 20%, 0.275Ω, 1.2A; Self Resonant Frequency: 20MHz; DC Resistance (DCR): 275mR; Test Frequency: 1MHz; Shielding: Shielded; Core Material: Ferrite; Saturation Current: 250mA; Inductance: 4.7uH; Ratings: AEC-Q200; Case Code (Imperial): 0805; Current Rating: 1.2A; Tolerance: 20%; Min Operating Temperature: -40°C; Mount: Surface Mount; RoHS Compliant: Yes; Case Code (Metric): 2012; Case/Package: 0805; Packaging: Tape and Reel; Max Operating Temperature: 85°C
R8 = CMP-08839-029105-1: 52.3kΩ ±1% 0.4W 0805 Anti-Surge Chip Resistor AEC-Q200; Temperature Coefficient: 100ppm/°C; Max Power Dissipation: 400mW; Resistance: 52.3kR; Min Operating Temperature: -55°C; Number of Terminations: 2; RoHS Compliant: Yes; Package Quantity: 5000; Case/Package: 0805; Height: 0.026inch; Width: 0.049inch; Features: Automotive AEC-Q200; Packaging: Tape and Reel; Length: 0.079inch; Series: ESR10; Max Operating Temperature: 155°C; Tolerance: 1%; Resistor Type: Thick Film
R9 = CMP-03412-049031-1: Thin Film Chip Resistors Automotive Grade 10kΩ 0.5% 50ppm/°C 0805; Max Power Dissipation: 125mW; Resistance: 10kR; Ratings: AEC-Q200; Length: 0.079inch; Temperature Coefficient: 50ppm/°C; Height: 0.024inch; Min Operating Temperature: -55°C; Case/Package: 0805; Tolerance: 0.5%; RoHS Compliant: Yes; Features: Moisture Resistant; Number of Terminations: 2; Max Operating Temperature: 155°C; Series: AT; Packaging: Tape and Reel; Width: 0.049inch; Resistor Type: Thin Film
R32 = CMP-03412-037959-1: RES 200kΩ ±5% 0.063W 0402; Power Rating: 62.5mW; Max Power Dissipation: 63mW; Resistance: 200kR; Temperature Coefficient: 100ppm/°C; Voltage Rating: 50V; Width: 0.5mm; Packaging: Tape and Reel; Termination: SMD/SMT; Case Code (Imperial): 0402; Features: Moisture Resistant; Case/Package: 0402; RoHS Compliant: Yes; Series: AC; Tolerance: 5%; Case Code (Metric): 1005; Height: 0.015inch; Resistor Type: Thick Film; Max Operating Temperature: 155°C; Length: 0.039inch; Number of Terminations: 2; Min Operating Temperature: -55°C
R33 = CMP-02407-005152-1: RES Thick Film, 50kΩ, 1%, 0.063W, 100ppm/°C, 0402; Power Rating: 63mW; Voltage Rating: 50V; Resistance: 50kR; Package Quantity: 10000; Case/Package: 0402; Max Operating Temperature: 155°C; Case Code (Metric): 1005; Termination: SMD/SMT; Lead Free: Lead Free; Height: 0.35mm; Width: 0.5mm; Packaging: Tape and Reel; Min Operating Temperature: -55°C; Length: 1mm; Tolerance: 1%; Case Code (Imperial): 0402; Weight: 2.3E-05oz
R34 = CMP-1011-00001-2: RES 0 OHM JUMPER 1/16W 0402; Manufacturer: Yageo / Phycomp; Part Number: RC0402JR-070RL
U6 = AP62200WU-7: No Description Available; Manufacturer_Name: Diodes Inc; Copyright: Copyright (C) 2026 Ultra Librarian. All rights reserved.; Manufacturer_Part_Number: AP62200WU-7; RefDes: RefDes; Type: Type
U8 = CMP-12756-000036-1: IC REG LINEAR 3.3V 300MA SOT23-3; Accuracy: 1%; Max Input Voltage: 13.2V; Number of Outputs: 1; Polarity: Positive; Power Supply Rejection Ratio (PSRR): 75dB; Quiescent Current: 150uA; Min Input Voltage: 2.5V; Output Type: Fixed; Dropout Voltage: 250mV; Height: 1.3mm; Weight: 0.000282oz; Packaging: Tape and Reel; Length: 3.02mm; Width: 1.7mm; Max Operating Temperature: 125°C; Output Voltage: 3.3V; Min Operating Temperature: -40°C; Output Current: 300mA; Number of Pins: 3; Number of Regulators: 1; Max Output Current: 300mA; Mount: Surface Mount; Case/Package: SOT-23-3; Package Quantity: 3000

## Sheet USB.SchDoc
size A4; SheetNumber: 7; SheetTotal: 7
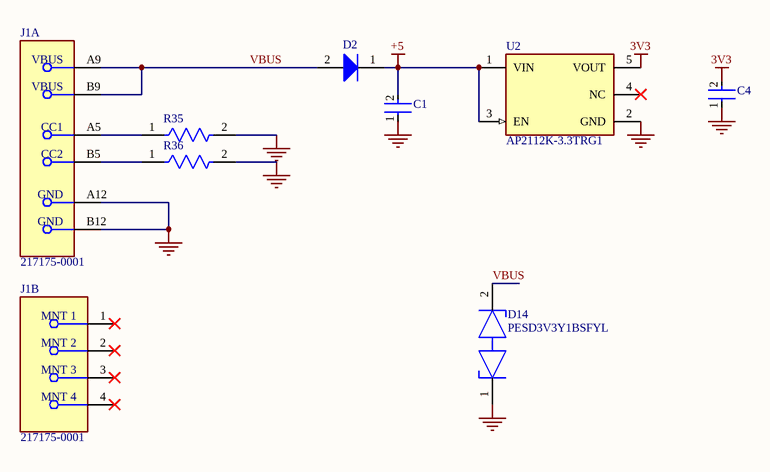
[diagram p6: USB.SchDoc]

### Parts
C1  C1608X5R1H105K080AB  [FP-C1608-080-0_1-IPC_B]  (value not drawn)
C4  C1608X5R1H105K080AB  [FP-C1608-080-0_1-IPC_B]  (value not drawn)
D2  NSR0320MW2T1G  [ONSC-SOD-323-2-477-02_V]  (value not drawn)
D14  PESD3V3Y1BSFYL  [FP-SOD962-2-CA-MFG]
J1  217175-0001  [FP-217175-0001-MFG]  (parts A,B of 2)
R35  RN73R1ETTP5101F25  [FP-RN73R1E-IPC_C]  (value not drawn)
R36  RN73R1ETTP5101F25  [FP-RN73R1E-IPC_C]  (value not drawn)
U2  AP2112K-3.3TRG1  [FP-SOT25-IPC_A]

### Nets
3V3: C4.2 U2.5(VOUT)
+5: C1.2 D2.1(K) U2.1(VIN) U2.3(EN)
GND: C1.1 C4.1 D14.1 J1.A12(GND) J1.B12(GND) R35.2 R36.2 U2.2(GND)
VBUS: D2.2(A) D14.2 J1.A9(VBUS) J1.B9(VBUS)
NetJ1_A5: J1.A5(CC1) R35.1
NetJ1_B5: J1.B5(CC2) R36.1

Not connected (* = marked no-connect by the designer): J1 1(MNT_1)* 2(MNT_2)* 3(MNT_3)* 4(MNT_4)*; U2 4(NC)*

### Library data of the parts
C1 C4 = CMP-2000-06025-2: Multilayer Ceramic Capacitors 1μF ±10% 50V X5R SMD 0603; Capacitance: 1uF; Lead Free: Lead Free; Height: 0.8mm; Mount: Surface Mount; Radiation Hardening: No; Thickness: 0.035inch; Length: 1.6mm; Max Operating Temperature: 85°C; REACH SVHC: No SVHC; Min Operating Temperature: -55°C; Construction: Flat; RoHS Compliant: Yes; Voltage Rating: 50V; Dielectric: X5R; Packaging: Tape and Reel; Termination: SMD/SMT; Voltage Rating (DC): 50V; Case Code (Imperial): 0603; Voltage: 50V; Width: 0.031inch; Weight: 7.1E-05oz; Depth: 0.8mm; Case Code (Metric): 1608; Series: C; Case/Package: 0603; Tolerance: 10%; Resistor Type: Ceramic; Number of Pins: 2; Dielectric Material: Ceramic; Package Quantity: 1
D2 = CMP-1055-00466-1: Schottky Barrier Diode, 2-Pin SOD-323, Pb-Free, Tape and Reel; Manufacturer: On Semiconductor; Configuration: Single; IFSM Max (A): 5; Mounting Technology: Surface Mount; Packing: Tape and Reel; PackageDescription: 2-Pin SOD, Body 1.7 x 1.25 mm; ComponentLink3Description: Package Specification; PartNumber: NSR0320MW2T1G; ComponentLink1URL: http://www.onsemi.com/; PackageReference: SOD-323-2-477-02; RoHS: TRUE; PackageVersion: Rev. H, 03/2007; DatasheetVersion: Rev. 4; ComponentLink1Description: Manufacturer URL; ComponentLink3URL: http://www.onsemi.com/pub_link/Collateral/477-02.PDF.1; ComponentLink2Description: Datasheet; ComponentLink2URL: http://www.onsemi.cn/pub_link/Collateral/NSR0320MW2T1-D.PDF
D14 = CMP-11424-92175759-2: as D12 on sheet Sensor_Controller; Height: 320µm; RoHS: Non-Compliant; Ambient Temperature Range High: 125°C; NexarPartId: 92175759; Direction: Bidirectional; Lifecycle Status: Production; Schedule B: 8536300000
J1 = CMP-04767-000026-1: CONN RCP USB2.0 C 6+18P SMD RA
R35 R36 = CMP-04015-008529-1: 5.1kΩ ±1% 0.063W, 1/16W Chip Resistor 0402 (1005 Metric) Moisture Resistant Thin Film
U2 = CMP-12756-000035-1: IC REG LINEAR 3.3V 600MA SOT25; Number of Regulators: 1; Output Type: Fixed; Polarity: Positive; Min Input Voltage: 2.5V; Max Input Voltage: 6V; Accuracy: 1.5%; Quiescent Current: 55uA; Dropout Voltage: 250mV; Min Operating Temperature: -40°C; Length: 3.1mm; Output Current: 600mA; Max Operating Temperature: 85°C; Package Quantity: 1; Output Voltage: 3.3V; Width: 1.7mm; Number of Outputs: 1; Packaging: Tape and Reel; Height: 1.3mm; Lead Free: Lead Free; Max Output Current: 600mA; Case/Package: SOT-23-5; Mount: Surface Mount; Number of Pins: 5

## Nets that join several sheets
3V3: Sensor_Controller (13 pins), IR_Sensor (7 pins), comms_interface (C5.1 R6.2 U5.8), Power (C32.1 U8.2), USB (C4.2 U2.5)
GND: Sensor_Controller (14 pins), IR_LED (D9.1 D10.1 D11.1 J3.4), IR_Sensor (19 pins), comms_interface (7 pins), Power (9 pins), USB (8 pins)
LED Power: IR_LED (D11.2 J3.1), Power (5 pins)
VIN: comms_interface (J2.3), Power (5 pins)
ADC1 IN0: Sensor_Controller (U1.7), IR_Sensor (C37.2 R45.2)
ADC1 IN1: Sensor_Controller (U1.8), IR_Sensor (C38.2 R46.2)
Direction Control: Sensor_Controller (U1.23), comms_interface (R5.2 U5.2 U5.3)
LED Control: Sensor_Controller (U1.17), IR_LED (D9.2 J3.3)
PWM LED: Sensor_Controller (U1.18), IR_LED (D10.2 J3.2)
RX: Sensor_Controller (U1.21), comms_interface (R6.1 U5.1)
TX: Sensor_Controller (U1.19), comms_interface (U5.4)

## Assembly variants
Variant 1A: not fitted J2 J3 J5 J6 U1